# EasyEDA Pro project ProProject_Access Control Contactor Switch_2024-06-07.epro

# Schematic V2.0.1 Schematic
Create Date: 2024-06-04; Page Name: Main Page.V2.0.1 Schematic; Project Name: Access Control Contactor Switch; Schematic Name: V2.0.1 Schematic; Update Date: 2024-06-07; Company: RIT SHED MAKERSPACE; Drawn: Jim Heaney; Page Size: A4; Part Number: JLCPCB-002; Reviewed: Jim Heaney; Version: V0.1
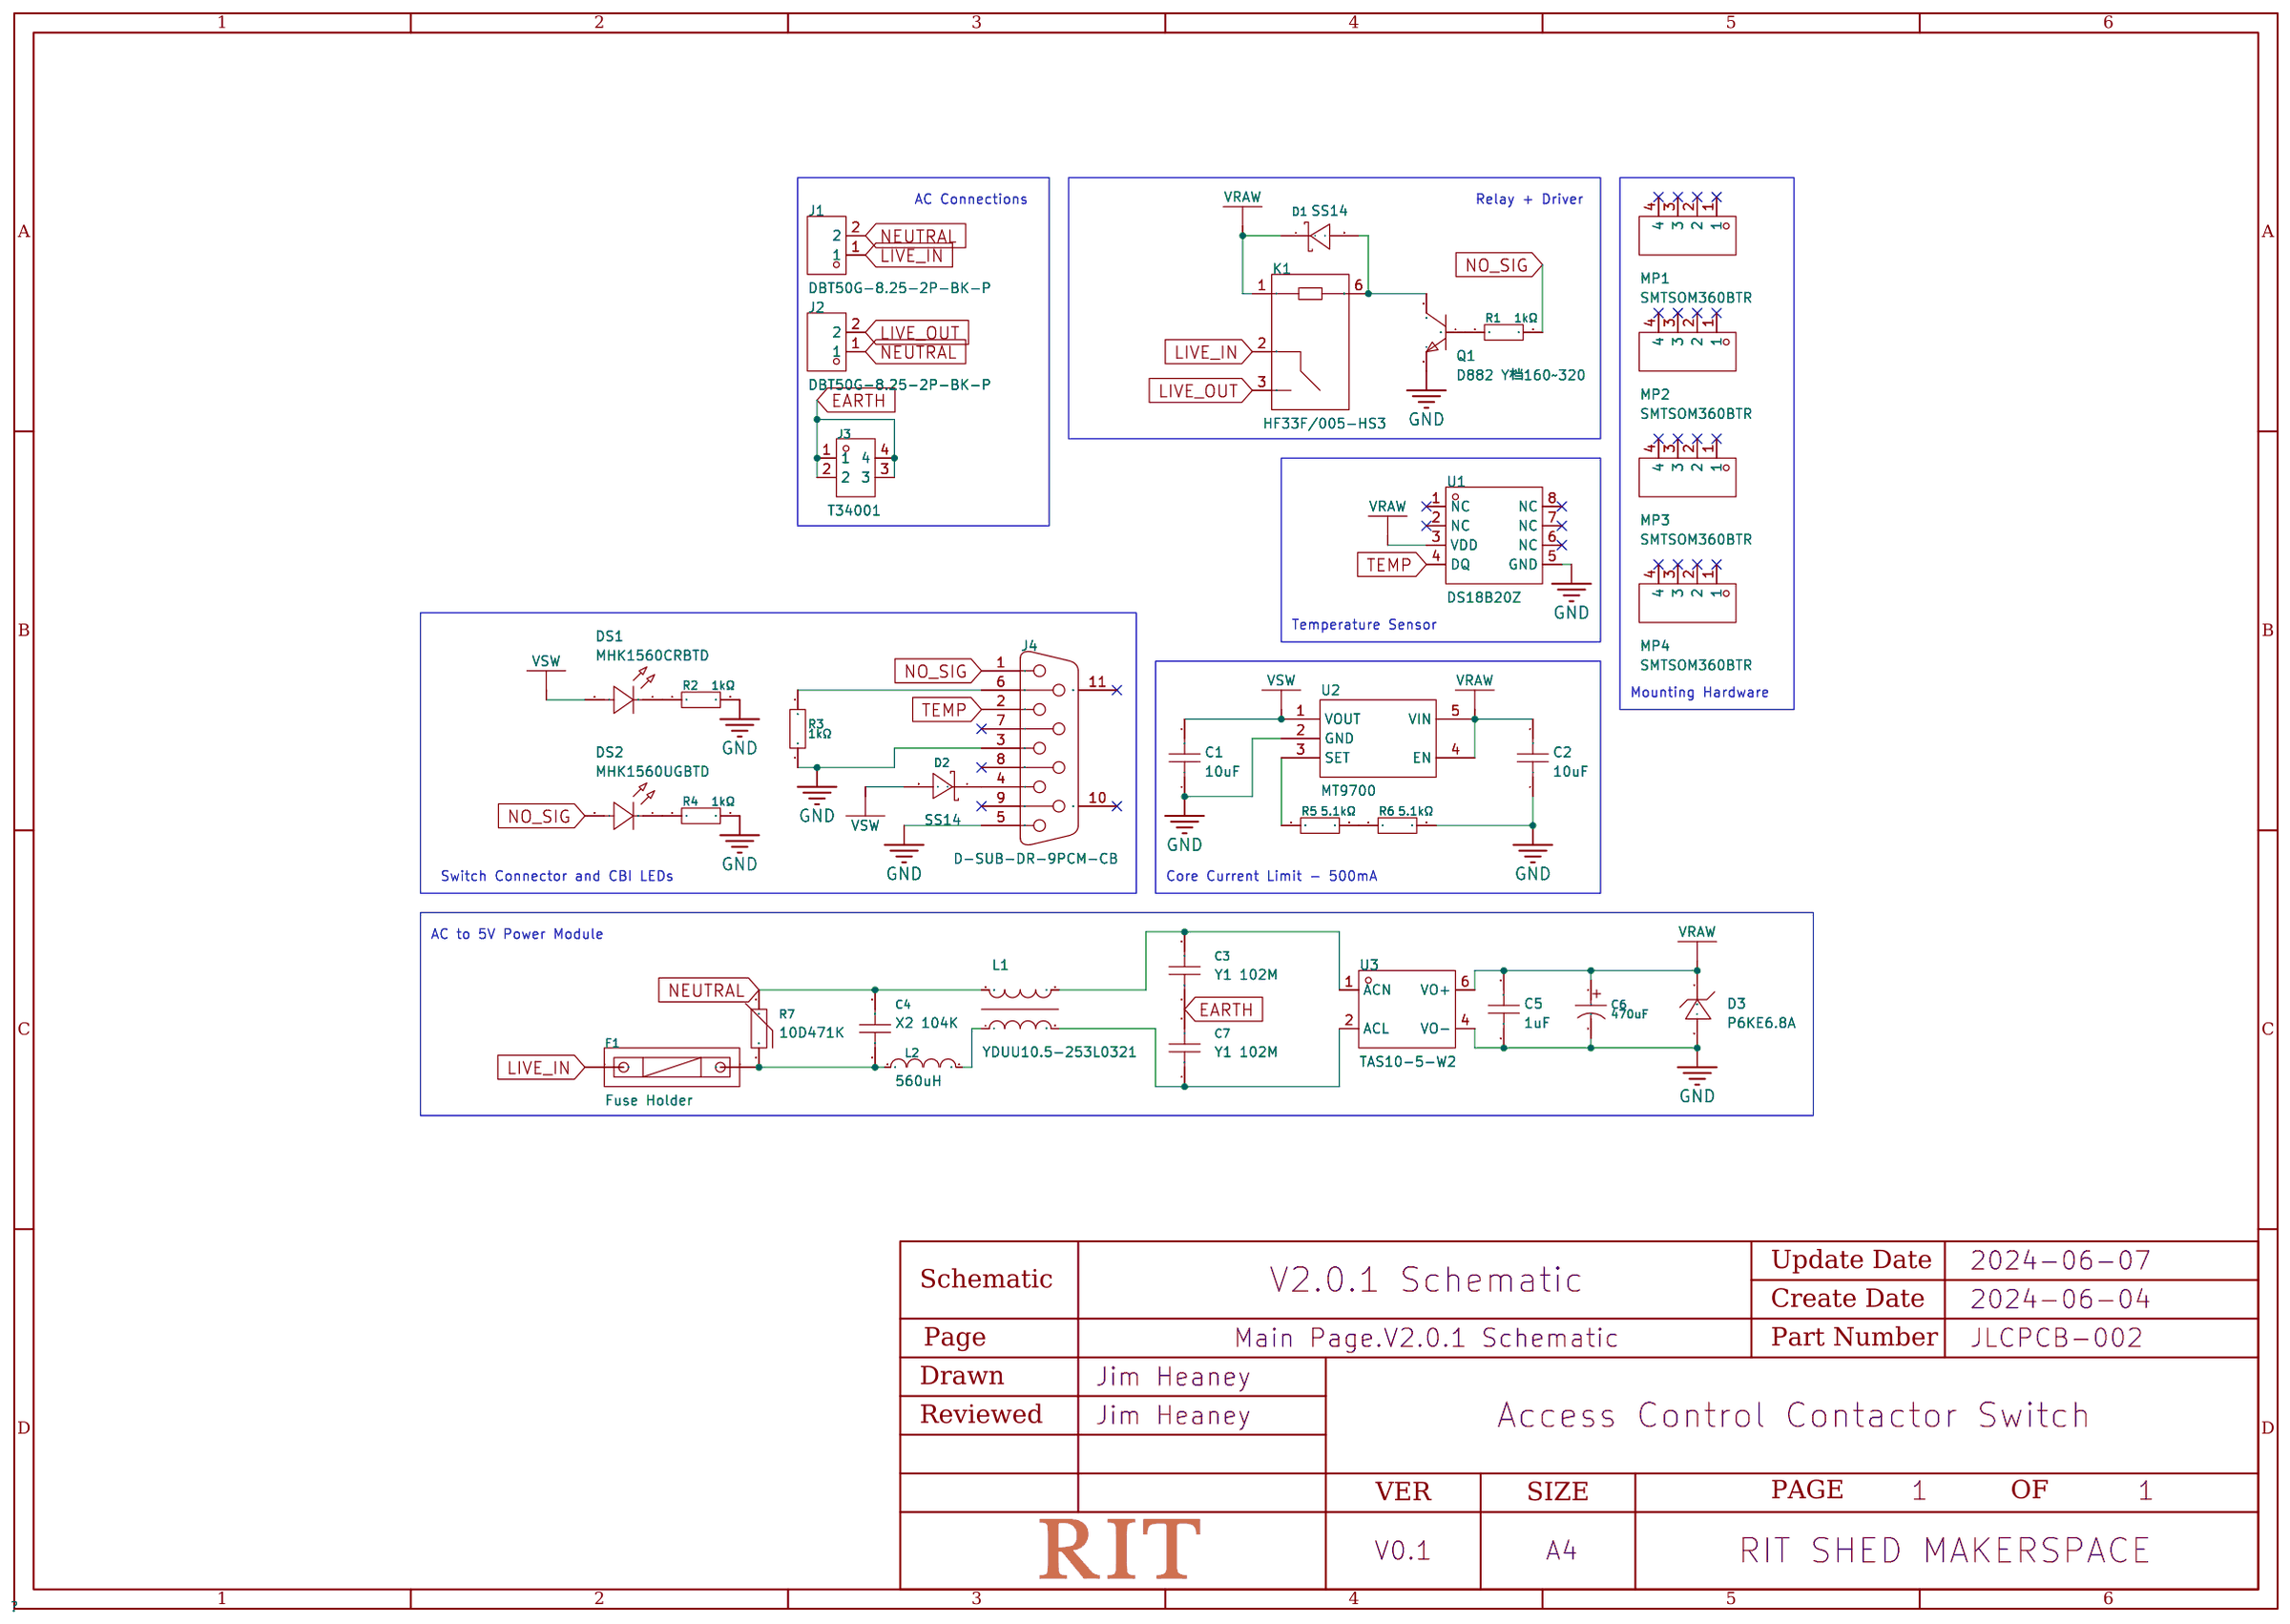
[diagram p0: schematic sheet]

## Parts
C1  10uF  [C0603]
C2  10uF  [C0603]
C3  1nF  [CAP-TH_L8.5-W5.0-P10.00-D0.6]
C4  100nF  [CAP-TH_L10.0-W5.0-P7.50-D0.6]
C5  1uF  [C1206]
C6  470uF  [CAP-TH_BD8.0-P3.50-D0.6-FD]
C7  1nF  [CAP-TH_L8.5-W5.0-P10.00-D0.6]
D1  SS14  [SMA_L4.2-W2.6-LS5.3-RD]
D2  SS14  [SMA_L4.2-W2.6-LS5.3-RD]
D3  P6KE6.8A  [DO-15_BD3.1-L6.7-P10.70-D0.9-RD]
DS1  MHK1560CRBTD  [LED-TH_MHK1560UGBTD]
DS2  MHK1560UGBTD  [LED-TH_MHK1560UGBTD]
F1  Fuse Holder  [FUSE-TH_L24.5-W9.8-P22.5]
J1  DBT50G-8.25-2P-BK-P  [CONN-TH_DBT50G-8.25-2P]
J2  DBT50G-8.25-2P-BK-P  [CONN-TH_DBT50G-8.25-2P]
J3  T34001  [CONN-TH_T34001]
J4  D-SUB-DR-9PCM-CB  [DB9-TH_ID09S33E4GV00LF]
K1  HF33F/005-HS3  [RELAYS-TH_HF33F-XX-HS1-XXX]
L1  YDUU10.5-253L0321  [IND-TH_4P-L19.0-W17.0]
L2  560uH  [IND-TH_BD9.0-P5.00-D0.7]
MP1  SMTSOM360BTR  [SMD_BD5.6-D4.1]
MP2  SMTSOM360BTR  [SMD_BD5.6-D4.1]
MP3  SMTSOM360BTR  [SMD_BD5.6-D4.1]
MP4  SMTSOM360BTR  [SMD_BD5.6-D4.1]
Q1  D882 Y档160~320  [SOT-89-3_L4.5-W2.5-P1.50-LS4.2-BR]
R1  1kΩ  [R0603]
R2  1kΩ  [R0603]
R3  1kΩ  [R0603]
R4  1kΩ  [R0603]
R5  5.1kΩ  [R0603]
R6  5.1kΩ  [R0603]
R7  10D471K  [RES-TH_L12.5-W6.7-P7.50-D1.2]
U1  DS18B20Z  [SOP-8_L4.9-W3.9-P1.27-LS6.0-BL]
U2  MT9700  [SOT-23-5_L3.0-W1.7-P0.95-LS2.8-BR]
U3  TAS10-5-W2  [PWRM-TH_TAS10-XX-W2]

## Library data of the parts
C1 C2 = CL10A106MA8NRNC: Capacitance: Tolerance:±20% Tolerance:±20% Voltage Rated: Temperature Coefficient:; LCSC Part Name: 10uF ±20% 25V; Supplier Part: C96446; Manufacturer: SAMSUNG(三星); Supplier Footprint: 0603; Datasheet: https://atta.szlcsc.com/upload/public/pdf/source/20170325/1490427913016.pdf; Supplier: LCSC; Tolerance: ±20%
C3 C7 = VY1102M31Y5UC63V0: Capacitance: Tolerance:±20% Tolerance:±20% Voltage(AC):760V Subclass: Operating Temperature:-40℃~+125℃ Operating Temperature:-40℃~+125℃; LCSC Part Name: 等级:X1,Y1 1nF ±20% 760V; Supplier Part: C1620957; Manufacturer: VISHAY(威世); Supplier Footprint: 插件,P=10mm; JLCPCB Part Class: Extended Part; Datasheet: https://atta.szlcsc.com/upload/public/pdf/source/20210503/4C6D9DFEC0766624DBEA7F26F929BB18.pdf; Supplier: LCSC; Tolerance: ±20%; Voltage(AC): 760V; Operating Temperature: -40℃~+125℃
C4 = PX104K2C0702: Capacitance: Tolerance:±10% Tolerance:±10% Voltage(AC):310V；380V；350V Subclass: Operating Temperature:-40℃~+110℃ Operating Temperature:-40℃~+110℃; LCSC Part Name: 等级:X2 100nF ±10% 310V 350V 380V; Supplier Part: C2693793; Manufacturer: KYET(科雅); Supplier Footprint: 插件,P=7.5mm; JLCPCB Part Class: Extended Part; Datasheet: https://atta.szlcsc.com/upload/public/pdf/source/20230824/212A883DA7F3524E26A294E17BC5A0F4.pdf; Supplier: LCSC; Tolerance: ±10%; Voltage(AC): 310V；380V；350V; Operating Temperature: -40℃~+110℃
C5 = CL31B105KBHNNNE: Capacitance: Tolerance:±10% Tolerance:±10% Voltage Rated: Temperature Coefficient:; LCSC Part Name: 1uF ±10% 50V; Supplier Part: C1848; Manufacturer: SAMSUNG(三星); Supplier Footprint: 1206; JLCPCB Part Class: Basic Part; Datasheet: https://atta.szlcsc.com/upload/public/pdf/source/20160218/1457707763339.pdf; Supplier: LCSC; Tolerance: ±10%
C6 = NXA 16V470 8*11.5: Capacitance: Tolerance:±20% Tolerance:±20% Rated Voltage: Lead Spacing: φD: L: Lifetime @ Temp:7000hrs@105℃; LCSC Part Name: 470uF ±20% 16V; Supplier Part: C165653; Manufacturer: SAMYOUNG(韩国三莹); Supplier Footprint: 插件,D8xL11.5mm; JLCPCB Part Class: Extended Part; Datasheet: https://atta.szlcsc.com/upload/public/pdf/source/20190920/C430850_914054AA82C37226ADDF1C96892D647D.pdf; Supplier: LCSC; Tolerance: ±20%; Lifetime @ Temp: 7000hrs@105℃
D1 D2 = SS14_C2480: Diode Configuration:Single Forward Voltage (Vf@If):550mV@1A Reverse Voltage (Vr):40V Average Rectified Current (Io):1A Reverse Leakage Current (Ir):500uA@40V; LCSC Part Name: 电压:40V 电流:1A; Supplier Part: C2480; Manufacturer: MDD; Supplier Footprint: SMA(DO-214AC); JLCPCB Part Class: Basic Part; Datasheet: https://atta.szlcsc.com/upload/public/pdf/source/20230712/2DB6064CFBB99DE6DB116BEE8208BE66.pdf; Supplier: LCSC; Diode Configuration: Single; Forward Voltage (Vf@If): 550mV@1A; Reverse Voltage (Vr): 40V; Average Rectified Current (Io): 1A; Reverse Leakage Current (Ir): 500uA@40V
D3 = P6KE6.8A_C409413: polarity:Unidirectional Reverse Stand-Off Voltage (Vrwm):5.8V Maximum Clamping Voltage:10.5V Peak Pulse Current (Ipp)@10/1000us:58.1A Peak Pulse Power Dissipation (Ppp)@10/1000us:600W Breakdown Voltage:6.45V Type:TVS; LCSC Part Name: 单向TVS 5.8V截止 58.1A峰值脉冲; Supplier Part: C409413; Manufacturer: Littelfuse(美国力特); Supplier Footprint: DO-15; JLCPCB Part Class: Extended Part; Datasheet: https://atta.szlcsc.com/upload/public/pdf/source/20190918/C428845_B57D5261D681FB1F560979D110FF2C50.pdf; Supplier: LCSC; polarity: Unidirectional; Reverse Stand-Off Voltage (Vrwm): 5.8V; Maximum Clamping Voltage: 10.5V; Peak Pulse Current (Ipp)@10/1000us: 58.1A; Peak Pulse Power Dissipation (Ppp)@10/1000us: 600W; Breakdown Voltage: 6.45V; Type: TVS
DS1 = MHK1560CGBTD: 20mA 雾状红透镜 50mcd -40℃~+85℃ 632nm Red 85° 1.75V~2.2V Plugin,P=2.54mm Light Emitting Diodes (LED) ROHS; LCSC Part Name: 1560直插单灯翠绿色光; Supplier Part: C7470835; Manufacturer: MEIHUA(美华); Supplier Footprint: 插件,P=2.54mm; JLCPCB Part Class: Extended Part; Datasheet: https://atta.szlcsc.com/upload/public/pdf/source/20231114/0151DB1F997DCF286213A722D08B4BAA.pdf; Supplier: LCSC; Emitted Color: Emerald; Forward Voltage (VF): 1.75V~2.2V; Forward Current: 20mA; Dominant Wavelength: 520nm; Lens Color: 雾状绿透镜; Luminous Intensity: 1000mcd; Viewing Angle: 85°; Operating Temperature: -40℃~+85℃
DS2 = MHK1560UGBTD: Emitted Color:Emerald Forward Voltage (VF):1.75V~2.2V Forward Voltage (VF):1.75V~2.2V Forward Current:20mA Dominant Wavelength:520nm Dominant Wavelength:520nm Lens Color:雾状绿透镜 Luminous Intensity:1000mcd Luminous Intensity:1000mcd Viewing Angle:85° Operati; LCSC Part Name: 1560直插单灯翠绿色光; Supplier Part: C7470833; Manufacturer: MEIHUA(美华); Supplier Footprint: 插件,P=2.54mm; JLCPCB Part Class: Extended Part; Datasheet: https://atta.szlcsc.com/upload/public/pdf/source/20231114/0151DB1F997DCF286213A722D08B4BAA.pdf; Supplier: LCSC; Emitted Color: Emerald; Forward Voltage (VF): 1.75V~2.2V; Forward Current: 20mA; Dominant Wavelength: 520nm; Lens Color: 雾状绿透镜; Luminous Intensity: 1000mcd; Viewing Angle: 85°; Operating Temperature: -40℃~+85℃
F1 = 保险丝透明座: Fuseholder Type:- Fuse Type:- Fuse Size:-; LCSC Part Name: 保险丝座 5*20 透明座(两件套); Supplier Part: C58066; Manufacturer: xcfuse(旭程); JLCPCB Part Class: Extended Part; Datasheet: https://atta.szlcsc.com/upload/public/pdf/source/20201109/C58066_EF84FEEE40948BE1BD26BCA72E4FE443.pdf; Supplier: LCSC
J1 J2 = DBT50G-8.25-2P-BK-P: Barrier Type:带盖板 Pitch:8.25mm Structure:1x2P Mounting Style:直针 Pin Location:边脚 Number of Pins:2P Number of Rows:1 Current Rating (Max):20A Voltage Rating (Max):300V Wire Gauge - AWG:12~22 Wire Gauge - mm2:- Operating Temperature Range:-40℃~+105℃ Operating; LCSC Part Name: 8.25mm 1x2P 每排P数:2 排数:1 直针 边脚; Supplier Part: C918130; Manufacturer: DORABO(地博电气); Supplier Footprint: 插件,P=8.25mm; JLCPCB Part Class: Extended Part; Datasheet: https://atta.szlcsc.com/upload/public/pdf/source/20230406/BD06FC520627543F5A98A956DF48FD00.pdf; Supplier: LCSC; Barrier Type: 带盖板; Pitch: 8.25mm; Structure: 1x2P; Mounting Style: 直针; Pin Location: 边脚; Number of Pins: 2P; Number of Rows: 1; Current Rating (Max): 20A; Voltage Rating (Max): 300V; Wire Gauge - AWG: 12~22; Operating Temperature Range: -40℃~+105℃; Color: Black; Number of PINs Per Row: 2
J3 = T34001: LCSC Part Name: 四脚 M3 二件套; Supplier Part: C481448; Manufacturer: XFCN(兴飞); Supplier Footprint: 插件; JLCPCB Part Class: Extended Part; Datasheet: https://atta.szlcsc.com/upload/public/pdf/source/20200107/C481448_4214B4EB74A46B70BD82BA8A456D4EDD.pdf; Supplier: LCSC
J4 = D-SUB-DR-9PCM-CB: Connector Type:D-Sub Gender:Female Number of Pins:9P Mounting Style:Right-Angle Number of Rows:2 Current Rating (Max):3A Contact Plating:Tin Operating Temperature Range:-50℃~+105℃ Operating Temperature Range:-50℃~+105℃; LCSC Part Name: D-Sub 母 P数:9P; Supplier Part: C19077337; Manufacturer: XUNPU(讯普); Supplier Footprint: 弯插; JLCPCB Part Class: Extended Part; Datasheet: https://atta.szlcsc.com/upload/public/pdf/source/20231108/FB2E8AB0BE4F620DDF3F7F4D0B9AFB97.pdf; Supplier: LCSC; Connector Type: D-Sub; Gender: Female; Number of Pins: 9P; Mounting Style: Right-Angle; Number of Rows: 2; Current Rating (Max): 3A; Contact Plating: Tin; Operating Temperature Range: -50℃~+105℃
K1 = HF33F/005-HS3: Coil Voltage:5V Contact Form:一组常开:1A(SPST-常开) Pin Number:4 Contact Rating:5A@30VDC；5A@250VAC；10A@125VAC Maximum Switching Voltage:250V@AC；30V@DC Coil Rated Power:450mW Contact Material:AgNi Maximum Switching Current:10A Coil Type:无极性-单线圈 Coil Resistance:5; LCSC Part Name: 超小型中功率5V继电器 单刀单掷-常开; Supplier Part: C183618; Manufacturer: HF(宏发); Supplier Footprint: 插件,10.2x20.5mm; JLCPCB Part Class: Extended Part; Datasheet: https://atta.szlcsc.com/upload/public/pdf/source/20180327/C59752_A9300FE6DFDE208E0EF34134E9C8F3D9.pdf; Supplier: LCSC; Coil Voltage: 5V; Contact Form: 一组常开:1A(SPST-常开); Pin Number: 4; Contact Rating: 5A@30VDC；5A@250VAC；10A@125VAC; Maximum Switching Voltage: 250V@AC；30V@DC; Coil Rated Power: 450mW; Contact Material: AgNi; Maximum Switching Current: 10A; Coil Type: 无极性-单线圈; Coil Resistance: 55Ω; Contact Resistance: 100mΩ; Operate Time: 8ms; Release Time: 5ms; Operating Temperature: -40℃~+70℃
L1 = YDUU10.5-253L0321: Number of Lines:2 Withstanding Voltage:1.5kV@AC Inductance @ Frequency:25mH@1KHz; LCSC Part Name: UU10.5 25mH @1KHz; Supplier Part: C5200263; Manufacturer: YJYCOIN(益嘉源); Supplier Footprint: 插件,19x17x22mm; JLCPCB Part Class: Extended Part; Datasheet: https://atta.szlcsc.com/upload/public/pdf/source/20221019/CF3EF2D4E89C9F1A1EF6A77931981DBC.pdf; Supplier: LCSC; Number of Lines: 2; Withstanding Voltage: 1.5kV@AC; Inductance @ Frequency: 25mH@1KHz
L2 = PK0810-561KB: Inductance: Tolerance:±10% Tolerance:±10% Rated Current: DC Resistance (DCR): Type:工字电感; LCSC Part Name: 560uH ±10%; Supplier Part: C122800; Manufacturer: SXN(顺翔诺); Supplier Footprint: 插件; JLCPCB Part Class: Extended Part; Datasheet: https://atta.szlcsc.com/upload/public/pdf/source/20210810/BA6D1DA7D4BCBB7C641BC97B42CFC6FF.pdf; Supplier: LCSC; Tolerance: ±10%; Type: 工字电感
MP1-MP4 = SMTSOM360BTR: LCSC Part Name: YIYUAN(怡远)M3贴片螺母 铜镀锡 PCB贴片连接器SMTSOM360BTR; Supplier Part: C5221846; Manufacturer: YIYUAN(怡远); JLCPCB Part Class: Extended Part; Datasheet: https://atta.szlcsc.com/upload/public/pdf/source/20230202/A42D22DA7D93D728E13784C4003E4077.pdf; Supplier: LCSC
Q1 = D882 Y档160~320: Transistor Type: Collector Current (Ic): Collector-Emitter Breakdown Voltage (Vceo): Power Dissipation (Pd):; LCSC Part Name: D882 Y档160~320(RANGE:160-320) Y档 160~320; Supplier Part: C9634; Manufacturer: CJ(江苏长电/长晶); Supplier Footprint: SOT-89-3; JLCPCB Part Class: Basic Part; Datasheet: https://atta.szlcsc.com/upload/public/pdf/source/20121027/1457706543612.pdf; Supplier: LCSC
R1-R4 = 0603WAF1001T5E: Type:Thick Film Resistors Resistance:1kΩ Tolerance:±1% Tolerance:±1% Power(Watts): Overload Voltage (Max): Temperature Coefficient:±100ppm/℃ Temperature Coefficient:±100ppm/℃ Operating Temperature Range:-55℃~+155℃ Operating Temperature Range:-55℃~+155℃; LCSC Part Name: 1kΩ ±1% 100mW 厚膜电阻; Supplier Part: C21190; Manufacturer: UNI-ROYAL(厚声); Supplier Footprint: 0603; JLCPCB Part Class: Basic Part; Datasheet: https://atta.szlcsc.com/upload/public/pdf/source/20200306/C422600_1E6D84923E4A46A82E41ADD87F860B5C.pdf; Supplier: LCSC; Type: Thick Film Resistors; Tolerance: ±1%; Temperature Coefficient: ±100ppm/℃; Operating Temperature Range: -55℃~+155℃
R5 R6 = 0603WAF5101T5E: Type:Thick Film Resistors Resistance:5.1kΩ Tolerance:±1% Tolerance:±1% Power(Watts): Overload Voltage (Max): Temperature Coefficient:±100ppm/℃ Temperature Coefficient:±100ppm/℃ Operating Temperature Range:-55℃~+155℃ Operating Temperature Range:-55℃~+155℃; LCSC Part Name: 5.1kΩ ±1% 100mW 厚膜电阻; Supplier Part: C23186; Manufacturer: UNI-ROYAL(厚声); Supplier Footprint: 0603; JLCPCB Part Class: Basic Part; Datasheet: https://atta.szlcsc.com/upload/public/pdf/source/20200306/C422600_1E6D84923E4A46A82E41ADD87F860B5C.pdf; Supplier: LCSC; Type: Thick Film Resistors; Tolerance: ±1%; Temperature Coefficient: ±100ppm/℃; Operating Temperature Range: -55℃~+155℃
R7 = 10D471K_C8760: Varistor Voltage:423V~517V Varistor Voltage:423V~517V Clamping Voltage: Allowable Voltage (DC): Allowable Voltage (AC): Peak Current: Maximum Energy:42.3J Maximum Energy:42.3J Typical Capatitance:190pF@1kHz; LCSC Part Name: 钳位电压775V 42.3焦耳 插件压敏电阻; Supplier Part: C8760; Manufacturer: RUILON(瑞隆源); Supplier Footprint: 插件; JLCPCB Part Class: Extended Part; Datasheet: https://atta.szlcsc.com/upload/public/pdf/source/20160725/1469440740918.pdf; Supplier: LCSC; Varistor Voltage: 423V~517V; Maximum Energy: 42.3J; Typical Capatitance: 190pF@1kHz
U1 = DS18B20Z: Resolution:±0.4℃ Resolution:±0.4℃ Supply Voltage:2.5V~5.5V Supply Voltage:2.5V~5.5V; LCSC Part Name: 温度传感器; Supplier Part: C695837; Manufacturer: UMW(友台半导体); Supplier Footprint: SOIC-8; JLCPCB Part Class: Extended Part; Datasheet: https://atta.szlcsc.com/upload/public/pdf/source/20231109/DC3DA9D47D486EF40A6E0F08B9A498E3.pdf; Supplier: LCSC; Resolution: ±0.4℃; Supply Voltage: 2.5V~5.5V
U2 = MT9700: Supplier Part: C89855; Manufacturer: 西安航天民芯; Supplier Footprint: SOT-23-5; Datasheet: https://atta.szlcsc.com/upload/public/pdf/source/20170418/1492481333031.pdf; Supplier: LCSC
U3 = TAS10-5-W2: Supplier Part: C2687655; Manufacturer: TDPOWER(腾达电源); Supplier Footprint: 插件,25x39mm; JLCPCB Part Class: Extended Part; Datasheet: https://atta.szlcsc.com/upload/public/pdf/source/20210914/95F169B7B21081D929A6CFE8A15609A6.pdf; Supplier: LCSC

## Nets
GND: C1.1 C2.1 C5.1 C6.2 D3.2(A) J4.3 J4.5 Q1.3(E) R2.2 R3.1 R4.2 R6.2 U1.5(GND) U2.2(GND) U3.4(VO-)
EARTH: C3.1 C7.2 J3.1 J3.2 J3.3 J3.4
LIVE_IN: F1.1 J1.1 K1.2
LIVE_OUT: J2.2 K1.3
NEUTRAL: C4.2 J1.2 J2.1 L1.3 R7.2
NO_SIG: DS2.2(A) J4.1 R1.2
TEMP: J4.2 U1.4(DQ)
VRAW: C2.2 C5.2 C6.1 D1.1(K) D3.1(C) K1.1 U1.3(VDD) U2.4(EN) U2.5(VIN) U3.6(VO+)
VSW: C1.2 D2.2(A) DS1.2(A) U2.1(VOUT)
$1N413: J4.6 R3.2
$1N415: DS2.1(K) R4.1
$1N416: DS1.1(K) R2.1
$1N418: D2.1(K) J4.4
$1N733: R5.1 U2.3(SET)
$1N736: R5.2 R6.1
$1N1230: C4.1 F1.2 L2.1 R7.1
$1N1235: L1.4 L2.2
$1N1236: C7.1 L1.2 U3.2(ACL)
$1N1237: C3.2 L1.1 U3.1(ACN)
$1N1687: Q1.1(B) R1.1
$1N2025: D1.2(A) K1.6 Q1.2(C)

Not connected (* = marked no-connect by the designer): J4 7* 8* 9* 10(MH1)* 11(MH2)*; MP1 1* 2* 3* 4*; MP2 1* 2* 3* 4*; MP3 1* 2* 3* 4*; MP4 1* 2* 3* 4*; U1 1(NC)* 2(NC)* 6(NC)* 7(NC)* 8(NC)*

## Notes on the sheet
- AC Connections
- Relay + Driver
- Temperature Sensor
- Mounting Hardware
- Switch Connector and CBI LEDs
- Core Current Limit - 500mA
- AC to 5V Power Module

# Board V2.0.1 PCB
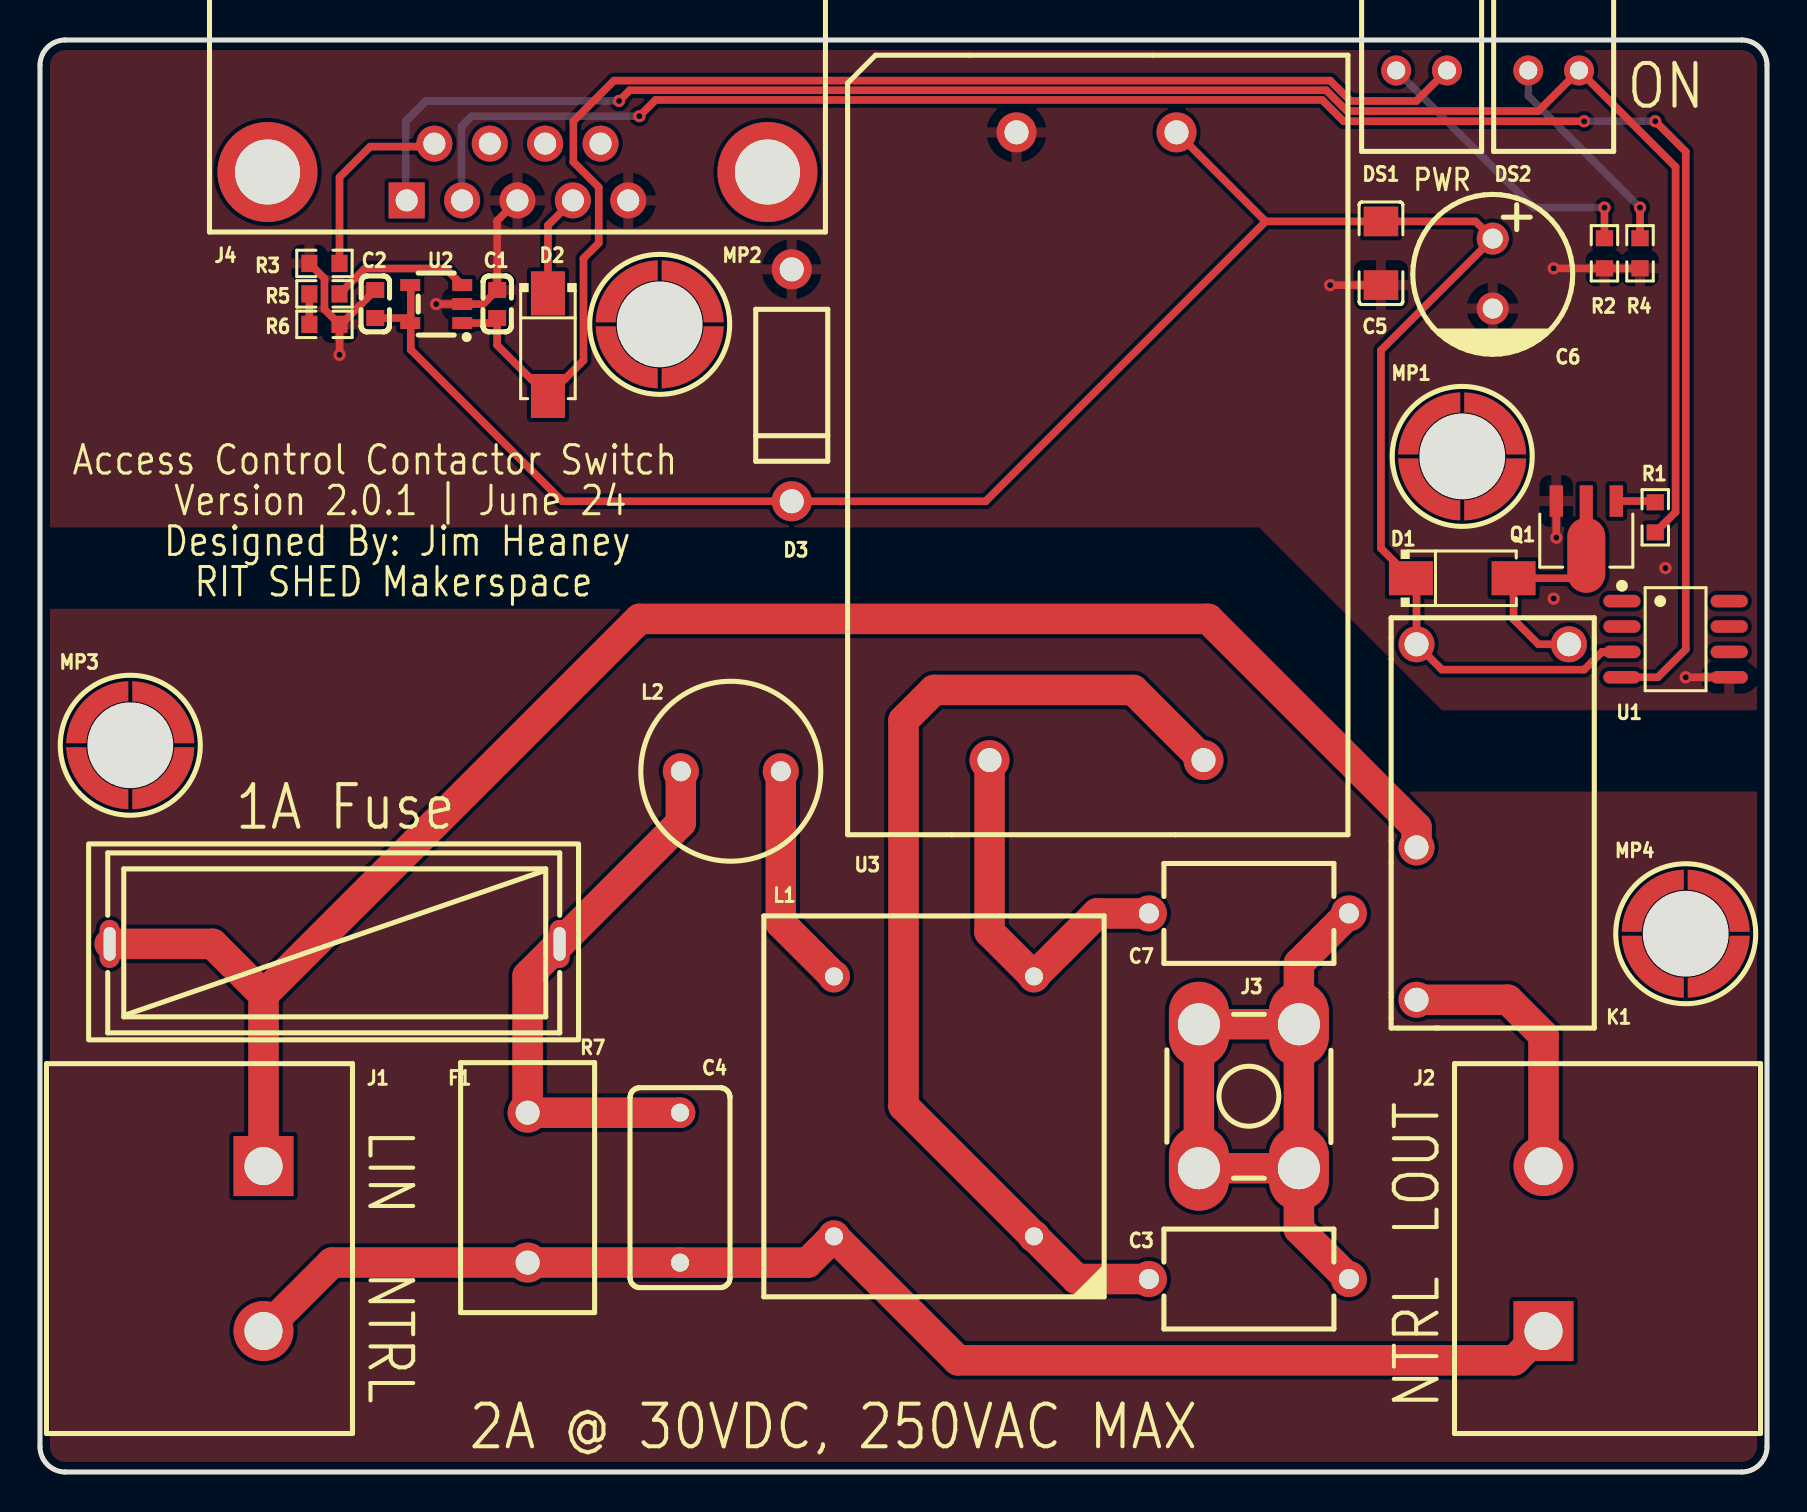
[diagram p1: board, top side]
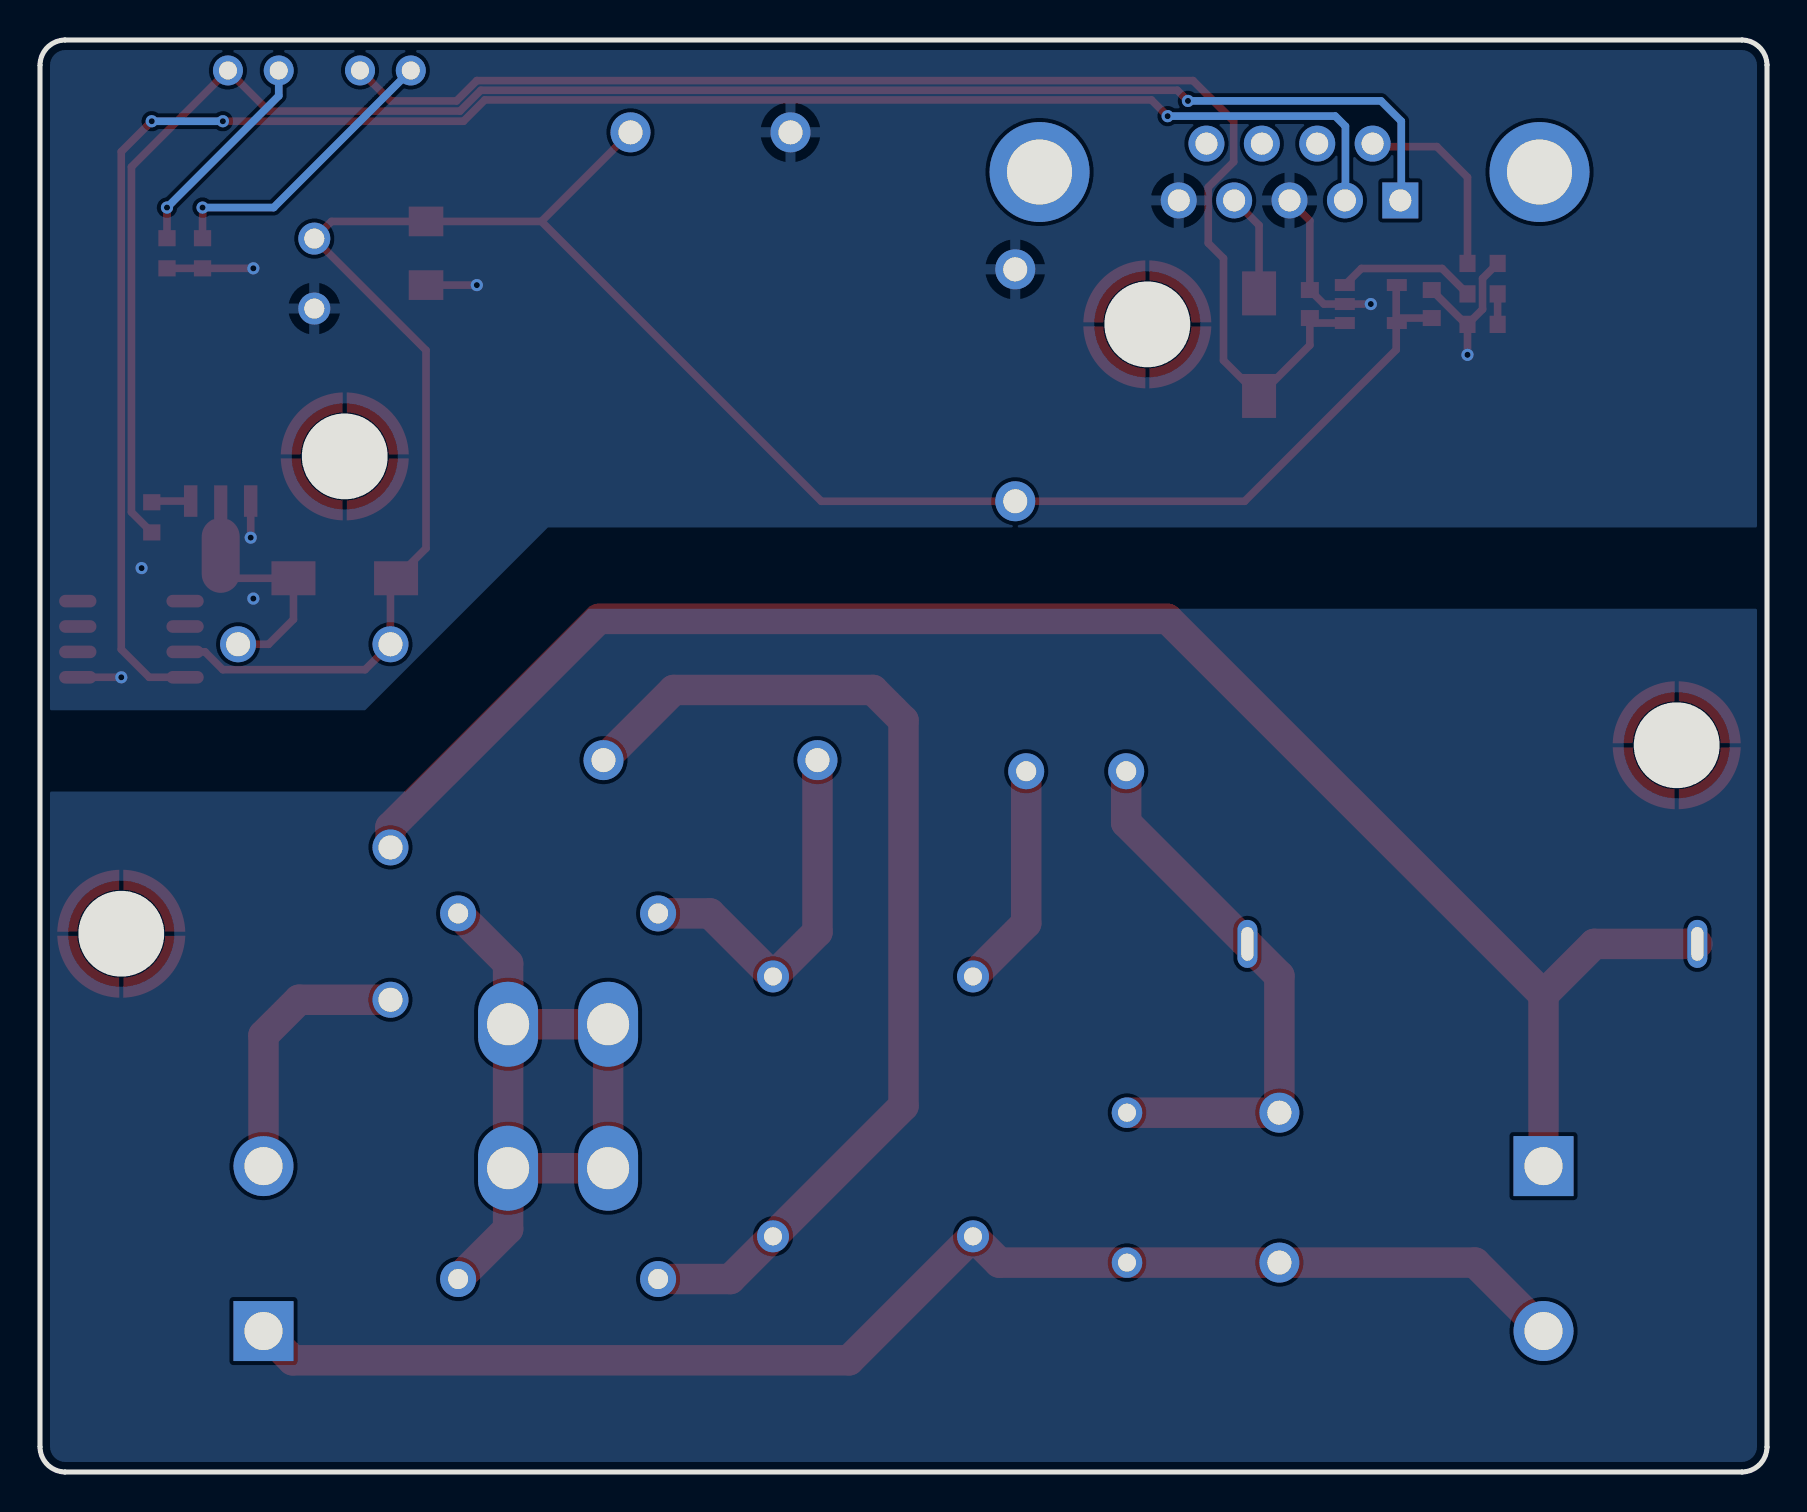
[diagram p2: board, bottom side, seen from below]

Outline 86.36 x 71.63 mm; copper layers: Top Layer, Bottom Layer. Coordinates in mm from the lower left corner of the outline.
Outline path: 0,70.36 0,1.27 arc(0.37,0.37) 1.27,0 85.09,0 arc(85.99,0.37) 86.36,1.27 86.36,70.36 arc(85.99,71.26) 85.09,71.63 1.27,71.63 arc(0.37,71.26) 0,70.36
Stack: Top Layer 0.035mm / Dielectric1 1.51mm FR4 er 4.5 / Bottom Layer 0.035mm

## Design rules (mm)
template: Custom Config
spacing copperThickness1oz (default): track to track 0.102, other pairs 0.152 to 0.3
spacing copperThickness2oz: track to track 0.203, other pairs 0.152 to 0.3
track width copperThickness1oz (default): min 0.127, default 0.254, max 2.54
track width copperThickness2oz: min 0.203, default 0.254, max 2.54
differential pair differentialPair (default): width min 0.127, default 0.254, max 2.54; gap min 0.152, default 0.152
via viaSize (default): diameter min 0.5, default 0.61, max 10; hole min 0.3, default 0.305, max 6.3
net STEAL uses stealcopper
pour e599 uses stealcopper

## Placement (name value [footprint] x y rotation side)
C1  10uF  [C0603]  22.86 58.42 270 top
C2  10uF  [C0603]  16.76 58.42 270 top
C3  1nF  [CAP-TH_L8.5-W5.0-P10.00-D0.6]  60.45 9.65 180 top
C4  100nF  [CAP-TH_L10.0-W5.0-P7.50-D0.6]  32 14.22 270 top
C5  1uF  [C1206]  67.06 60.96 90 top
C6  470uF  [CAP-TH_BD8.0-P3.50-D0.6-FD]  72.64 59.94 270 top
C7  1nF  [CAP-TH_L8.5-W5.0-P10.00-D0.6]  60.45 27.94 0 top
D1  SS14  [SMA_L4.2-W2.6-LS5.3-RD]  71.12 44.7 0 top
D2  SS14  [SMA_L4.2-W2.6-LS5.3-RD]  25.4 56.39 270 top
D3  P6KE6.8A  [DO-15_BD3.1-L6.7-P10.70-D0.9-RD]  37.59 54.36 90 top
DS1  MHK1560CRBTD  [LED-TH_MHK1560UGBTD]  69.09 70.1 180 top
DS2  MHK1560UGBTD  [LED-TH_MHK1560UGBTD]  75.69 70.1 180 top
F1  Fuse Holder  [FUSE-TH_L24.5-W9.8-P22.5]  14.73 26.42 0 top
J1  DBT50G-8.25-2P-BK-P  [CONN-TH_DBT50G-8.25-2P]  11.18 11.18 270 top
J2  DBT50G-8.25-2P-BK-P  [CONN-TH_DBT50G-8.25-2P]  75.18 11.18 90 top
J3  T34001  [CONN-TH_T34001]  60.45 18.8 0 top
J4  D-SUB-DR-9PCM-CB  [DB9-TH_ID09S33E4GV00LF]  23.88 65.02 180 top
K1  HF33F/005-HS3  [RELAYS-TH_HF33F-XX-HS1-XXX]  72.64 32.51 270 top
L1  YDUU10.5-253L0321  [IND-TH_4P-L19.0-W17.0]  44.7 18.29 90 top
L2  560uH  [IND-TH_BD9.0-P5.00-D0.7]  34.54 35.05 0 top
MP1  SMTSOM360BTR  [SMD_BD5.6-D4.1]  71.12 50.8 0 top
MP2  SMTSOM360BTR  [SMD_BD5.6-D4.1]  30.99 57.4 0 top
MP3  SMTSOM360BTR  [SMD_BD5.6-D4.1]  4.52 36.35 0 top
MP4  SMTSOM360BTR  [SMD_BD5.6-D4.1]  82.3 26.92 0 top
Q1  D882 Y档160~320  [SOT-89-3_L4.5-W2.5-P1.50-LS4.2-BR]  77.32 47.21 90 top
R1  1kΩ  [R0603]  80.77 47.75 270 top
R2  1kΩ  [R0603]  78.23 60.96 270 top
R3  1kΩ  [R0603]  14.22 60.45 0 top
R4  1kΩ  [R0603]  80.01 60.96 270 top
R5  5.1kΩ  [R0603]  14.22 58.93 180 top
R6  5.1kΩ  [R0603]  14.22 57.4 0 top
R7  10D471K  [RES-TH_L12.5-W6.7-P7.50-D1.2]  24.38 14.22 270 top
U1  DS18B20Z  [SOP-8_L4.9-W3.9-P1.27-LS6.0-BL]  81.79 41.66 270 top
U2  MT9700  [SOT-23-5_L3.0-W1.7-P0.95-LS2.8-BR]  19.81 58.42 0 top
U3  TAS10-5-W2  [PWRM-TH_TAS10-XX-W2]  52.83 51.31 90 top

## Footprints (pads in the part's own frame, mm; a bottom-side part is the same pattern mirrored in y, then rotated)
C0603
  rect 0.8x0.9 smd: 1(-0.7,0) 2(0.7,0)
C1206
  rect 1.485x1.728 smd: 1(-1.593,0) 2(1.593,0)
CAP-TH_BD8.0-P3.50-D0.6-FD
  round 1.6 hole 1: 1(-1.75,0) 2(1.75,0)
CAP-TH_L8.5-W5.0-P10.00-D0.6
  round 1.8 hole 1: 1(-5,0) 2(5,0)
CAP-TH_L10.0-W5.0-P7.50-D0.6
  round 1.524 hole 0.9: 1(-3.75,0) 2(3.75,0)
CONN-TH_DBT50G-8.25-2P
  rect 3x3 hole 1.9: 1(-4.125,0)
  round 3 hole 1.9: 2(4.125,0)
CONN-TH_T34001
  oval 3x4.25 hole 2.1: 1(-2.5,-3.6) 2(2.5,-3.6) 3(2.5,3.6) 4(-2.5,3.6)
DB9-TH_ID09S33E4GV00LF
  rect 1.8x1.8 hole 1.1: 1(5.54,1.42)
  round 1.8 hole 1.1: 2(2.77,1.42) 3(0,1.42) 4(-2.77,1.42) 5(-5.54,1.42) 6(4.155,-1.42) 7(1.385,-1.42) 8(-1.385,-1.42) 9(-4.155,-1.42)
  round 5 hole 3.25: 10(-12.5,0) 11(12.5,0)
DO-15_BD3.1-L6.7-P10.70-D0.9-RD
  round 2 hole 1.2: 1(-5.8,0) 2(5.8,0)
FUSE-TH_L24.5-W9.8-P22.5
  oval 1x2.4 hole 0.6x1.68: 1(-11.25,0) 2(11.25,0)
IND-TH_4P-L19.0-W17.0
  round 1.6 hole 0.9: 1(-6.5,-5) 2(6.5,-5) 3(-6.5,5) 4(6.5,5)
IND-TH_BD9.0-P5.00-D0.7
  round 1.8 hole 1: 1(-2.5,0) 2(2.5,0)
LED-TH_MHK1560UGBTD
  round 1.5 hole 0.9: 1(1.27,0) 2(-1.27,0)
PWRM-TH_TAS10-XX-W2
  round 2 hole 1.2: 1(-15.7,-5.35) 2(-15.7,5.35) 4(15.7,4) 6(15.7,-4)
R0603
  rect 0.806x0.864 smd: 1(-0.753,0) 2(0.753,0)
RELAYS-TH_HF33F-XX-HS1-XXX
  round 1.8 hole 1.2: 1(-8.89,-3.81) 2(1.27,-3.81) 3(8.89,-3.81) 6(-8.89,3.81)
RES-TH_L12.5-W6.7-P7.50-D1.2
  round 2 hole 1.2: 1(-3.749,0) 2(3.749,0)
SMA_L4.2-W2.6-LS5.3-RD
  rect 2.2x1.7 smd: 1(-2.566,0) 2(2.566,0)
SMD_BD5.6-D4.1
  custom 3.1x3.1 smd: 1(-2.102,1.65) 2(1.65,2.102) 3(2.102,-1.65) 4(-1.65,-2.102)
SOP-8_L4.9-W3.9-P1.27-LS6.0-BL
  oval 0.63x1.865 smd: 1(-1.905,-2.683) 2(-0.635,-2.683) 3(0.635,-2.683) 4(1.905,-2.683) 5(1.905,2.683) 6(0.635,2.683) 7(-0.635,2.683) 8(-1.905,2.683)
SOT-23-5_L3.0-W1.7-P0.95-LS2.8-BR
  rect 1x0.6 smd: 1(1.3,-0.95) 2(1.3,0) 3(1.3,0.95) 4(-1.3,0.95) 5(-1.3,-0.95)
SOT-89-3_L4.5-W2.5-P1.50-LS4.2-BR
  rect 1.575x0.672 smd: 1(1.356,-1.5) 3(1.356,1.5)
  custom 5.377x1.9 smd: 2(-1.356,0)

## Nets
As in the schematic.

Pads without a net: J4 7 8 9 10 11; MP1 1 2 3 4; MP2 1 2 3 4; MP3 1 2 3 4; MP4 1 2 3 4; U1 1 2 6 7 8

## Via types
v1: diameter 0.61, hole 0.305, Top Layer to Bottom Layer, 14 vias

## Routing (per net, layer and track width the routed paths; a pad name or vN(x,y) marks a point on that pad's centre or on a via; arc(x,y) is an arc through that point)
GND: length 26.8
  Top Layer w0.381: v1(19.81,58.42) U2.2 22.16,58.42 C1.1 22.86,62.59 J4.3 ; C5.1 v1(64.52,59.37) ; Q1.3 v1(75.82,46.74) ; R4.2 R2.2 v1(75.69,60.21) ; C2.1 15.05,57.4 R6.2 ; R6.2 v1(14.98,55.88) ; R6.2 14.22,58.16 14.22,59.7 R3.1 ; U1.5 v1(82.3,39.75)
  vias: v1(75.69,43.69) v1(81.28,45.21)
EARTH: length 37.6
  Top Layer w1.524: C7.2 62.95,25.44 J3.3 ; J3.2 J3.3 ; J3.2 62.95,12.15 C3.1 ; J3.2 J3.1 J3.4 J3.3
LIVE_IN: length 88.1
  Top Layer w1.524: 11.18,23.88 8.64,26.42 F1.1 ; 11.18,23.88 J1.1 ; 11.18,23.88 29.97,42.67 58.42,42.67 68.83,32.26 K1.2
LIVE_OUT: length 13.6
  Top Layer w1.524: K1.3 73.41,23.62 75.18,21.84 J2.2
NEUTRAL: length 69.1
  Top Layer w1.524: C4.2 38.39,10.47 L1.3 45.9,5.59 73.72,5.59 75.18,7.05 ; 32,10.47 R7.2 14.6,10.47 11.18,7.05
NO_SIG: length 90.1
  Top Layer w0.381: R1.2 81.79,48.01 81.79,65.28 DS2.2 74.93,68.07 65.36,68.07 64.32,69.11 29.49,69.11 v1(28.96,68.58)
  Bottom Layer w0.381: v1(28.96,68.58) 19.3,68.58 18.29,67.56 18.29,63.65 J4.1
TEMP: length 95.2
  Top Layer w0.381: U1.4 80.9,39.75 82.3,41.15 82.3,66.04 v1(80.77,67.56) ; v1(77.22,67.56) 65.18,67.56 64.12,68.63 30.78,68.63 v1(29.97,67.82)
  Bottom Layer w0.381: v1(29.97,67.82) 21.59,67.82 21.08,67.31 21.08,63.63 J4.2 ; v1(80.77,67.56) v1(77.22,67.56)
VRAW: length 109.5
  Top Layer w0.381: U2.5 18.51,57.72 C2.2 ; U2.4 18.54,59.34 18.54,56.13 26.12,48.56 D3.1 47.29,48.56 61.29,62.55 ; U1.3 78.11,41.02 77.22,40.13 70.1,40.13 K1.1 68.83,44.42 D1.1 67.06,46.2 67.06,56.11 C6.1 71.79,62.55 C5.2 61.29,62.55 ; U3.6 61.29,62.55
VSW: length 67.7
  Top Layer w0.381: U2.1 22.61,57.47 C1.2 22.86,56.36 D2.2 27.18,55.6 27.18,60.71 27.94,61.47 27.94,64.26 26.67,65.53 26.67,67.56 28.7,69.6 64.52,69.6 65.53,68.58 68.83,68.58 DS1.2
$1N413: length 9.7
  Top Layer w0.381: J4.6 19.57,66.29 16.51,66.29 14.98,64.76 R3.2
$1N415: length 10.7
  Top Layer w0.381: v1(80.01,63.25) R4.1
  Bottom Layer w0.381: DS2.1 74.42,68.83 v1(80.01,63.25)
$1N416: length 14.8
  Top Layer w0.381: v1(78.23,63.25) R2.1
  Bottom Layer w0.381: v1(78.23,63.25) 74.68,63.25 DS1.1
$1N418: length 5.2
  Top Layer w0.381: J4.4 25.4,62.36 D2.1
$1N733: length 7
  Top Layer w0.381: R5.1 16.25,60.2 20.28,60.2 U2.3
$1N736: length 1.5
  Top Layer w0.381: R5.2 R6.1
$1N1230: length 27.9
  Top Layer w1.524: R7.1 24.38,24.82 F1.2 32.04,32.48 L2.1 ; C4.1 24.39,17.97
$1N1235: length 11.4
  Top Layer w1.524: L1.4 37.04,27.45 L2.2
$1N1236: length 18.8
  Top Layer w1.524: C7.1 52.86,27.94 L1.2 47.48,27.01 U3.2
$1N1237: length 52.2
  Top Layer w1.524: U3.1 54.67,39.12 44.7,39.12 43.18,37.59 43.18,18.31 L1.1 51.84,9.65 C3.2
$1N1687: length 2
  Top Layer w0.381: Q1.1 80.71,48.57 R1.1
$1N2025: length 10.1
  Top Layer w0.381: Q1.2 77.32,44.81 77.22,44.7 D1.2 73.69,42.65 74.93,41.4 K1.6

## Copper pours and planes (outline as drawn; the poured copper is in the pictures)
GND on Top Layer: -6.1,47.24 60.96,47.24 70.1,38.1 87.88,38.1 87.88,73.15 -4.06,73.15 -6.1,71.12
GND on Bottom Layer: -1.02,47.24 60.96,47.24 70.1,38.1 87.88,38.1 87.88,84.33 88.39,84.84 4.57,84.84 -1.02,79.25
STEAL on Top Layer: -0.51,43.18 -0.51,-7.62 87.88,-7.62 88.39,-7.11 88.39,32.51 86.87,34.04 68.07,34.04 58.93,43.18
STEAL on Bottom Layer: -6.1,43.18 58.93,43.18 68.07,34.04 91.95,34.04 91.95,-4.06 -3.56,-4.06 -6.1,-1.52

## Text on the board
Top Silkscreen Layer: PWR | Access Control Contactor Switch | Designed By: Jim Heaney | Version 2.0.1 | June 24 | RIT SHED Makerspace | 1A Fuse | 2A @ 30VDC, 250VAC MAX | ON | LOUT | NTRL | LIN
